# EAGLE design pcf8563 (EAGLE 7.3.0)
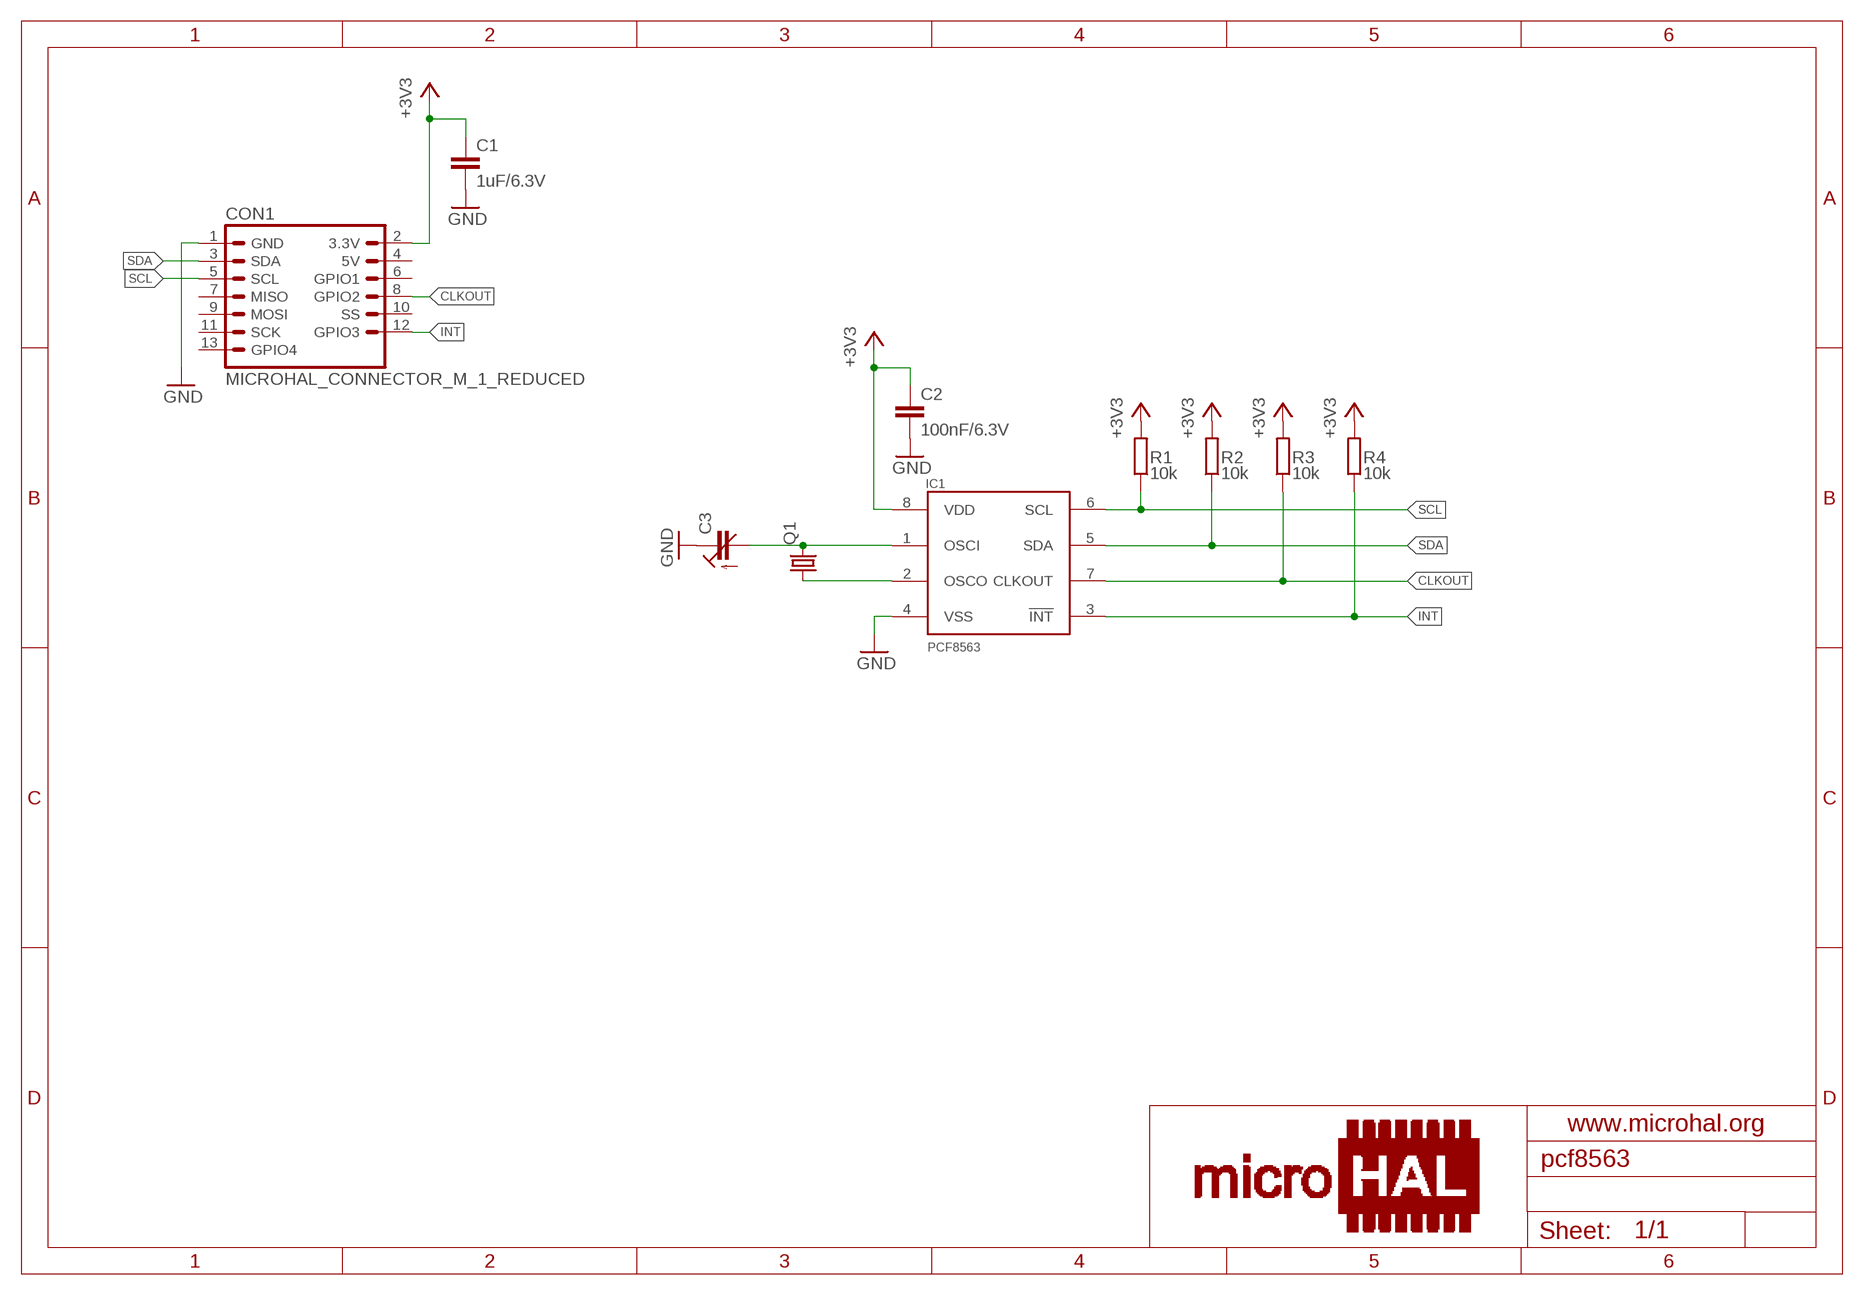
[diagram p0: schematic, sheet 1]

## Parts
C1  1uF/6.3V  C-EUC0805K  [C0805K]
C2  100nF/6.3V  C-EUC0603K  [C0603K]
C3  C-TRIMMTZBX4  [CTRIMTZBX4]
CON1  MICROHAL_CONNECTOR_M_1_REDUCED  [MICROHAL_CONNECTOR_M_1_REDUCED_EDGE]
IC1  PCF8563  [SO08]
Q1  CRYSTALTC38H  [TC38H]
R1  10k  R-EU_R0603  [R0603]
R2  10k  R-EU_R0603  [R0603]
R3  10k  R-EU_R0603  [R0603]
R4  10k  R-EU_R0603  [R0603]

## Nets
+3V3: C1.1 C2.1 CON1.2(3.3V) IC1.8(VDD) R1.2 R2.2 R3.2 R4.2
CLKOUT: CON1.8(GPIO2) IC1.7(CLKOUT) R3.1
GND: C1.2 C2.2 C3.1(E) CON1.1(GND) IC1.4(VSS)
INT: CON1.12(GPIO3) IC1.3(!INT) R4.1
N$1: C3.2(A) IC1.1(OSCI) Q1.2
N$2: IC1.2(OSCO) Q1.1
SCL: CON1.5(SCL) IC1.6(SCL) R1.1
SDA: CON1.3(SDA) IC1.5(SDA) R2.1
Unconnected: CON1.4(5V) CON1.6(GPIO1) CON1.7(MISO) CON1.9(MOSI) CON1.10(SS) CON1.11(SCK) CON1.13(GPIO4)

## Library data of the parts
C1 C2 = rcl:C-EU: CAPACITOR, European symbol
C3 = rcl:C-TRIMM: Trimm capacitor
CON1 = microhal-connector_v0.1:MICROHAL_CONNECTOR_M_1_REDUCED
IC1 = pcf8563:PCF8563
Q1 = crystal:CRYSTAL: CRYSTAL; OC_FARNELL: unknown; OC_NEWARK: unknown
R1-R4 = rcl:R-EU_: RESISTOR, European symbol

## Board
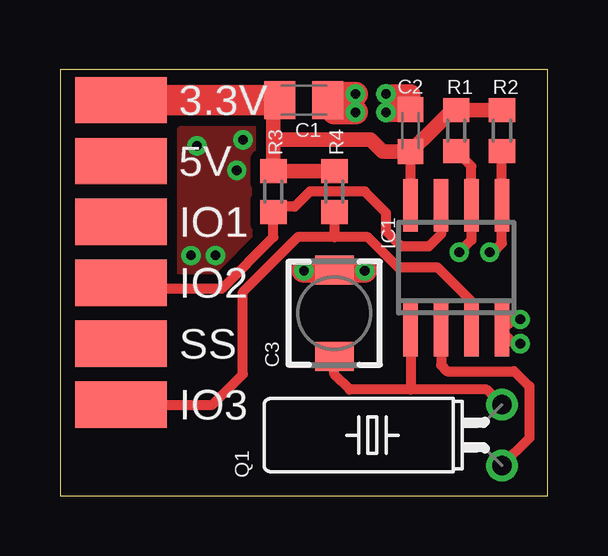
[diagram p1: board, top side]
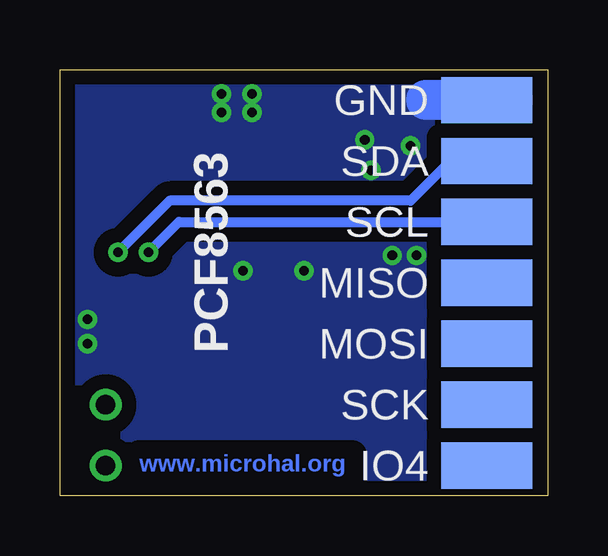
[diagram p2: board, bottom side, seen from below]

Size 20.32 x 17.78 mm. Coordinates in mm from the lower left corner, seen from the top.
Outline: 0,0 20.32,0 20.32,17.78 0,17.78 0,0
Copper layers (1*16): Top 0.035mm / dielectric 1.5mm / Bottom 0.035mm
Design rules "default *": minimum track width 10mil, minimum drill 24mil, track to track 8mil, track to pad 8mil, pad to pad 8mil, via to via 8mil, smd to smd 8mil, copper to edge 20mil, drill to drill 8mil, minimum pad ring 10mil, minimum via ring 8mil, stop-mask expansion 4mil, vias tented up to drill 0mil, thermal gap 10mil

### Footprints (pad centres in the part's own frame; a part is rotated, then mirrored left to right if it is on the bottom)
C0805K = smd 1.3 x 1.6: 1 -1,0; 2 1,0
C0603K = smd 1.05 x 1.08: 1 -0.875,0; 2 0.875,0
CTRIMTZBX4 = smd 1.6 x 1.2: 1 0,1.8; 2 0,-1.8
MICROHAL_CONNECTOR_M_1_REDUCED_EDGE = smd 1.93 x 3.81 bottom: 1 -7.62,0; 3 -5.08,0; 5 -2.54,0; 7 0,0; 9 2.54,0; 11 5.08,0; 13 7.62,0 | smd 1.93 x 3.81: 2 -7.62,0; 4 -5.08,0; 6 -2.54,0; 8 0,0; 10 2.54,0; 12 5.08,0
SO08 = smd 0.6 x 2.2: 1 -1.905,-2.6; 2 -0.635,-2.6; 3 0.635,-2.6; 4 1.905,-2.6; 5 1.905,2.6; 6 0.635,2.6; 7 -0.635,2.6; 8 -1.905,2.6
TC38H = drill 0.813: 1 -1.27,0; 2 1.27,0
R0603 = smd 1 x 1.1: 1 -0.85,0; 2 0.85,0

### Placement (x,y rotation side)
C1  10.16,16.51 0 top
C2  14.61,15.24 90 top
C3  11.43,7.62 0 top
CON1  2.54,8.89 270 top
IC1  16.51,9.53 0 top
Q1  18.41,2.54 90 top
R1  16.51,15.24 90 top
R2  18.41,15.24 90 top
R3  8.89,12.7 90 top
R4  11.43,12.7 90 top

### Tracks (layer width: path | path; a pad name or v marks a point on that pad's centre or on a via)
+3V3
  Top 0.406: IC1.8 C2.1
  Top 0.61: R2.2 R1.2 16.34,16.09 15.11,14.86 15.1,14.86 C2.1 13.45,14.37 12.95,14.86 8.89,14.86 | R4.2 R3.2 8.89,14.86 | 8.89,14.86 8.89,16.24 C1.1
  Top 1.27: CON1.2 C1.1
CLKOUT
  Top 0.406: IC1.7 15.88,10.92 15.37,10.41 14.22,10.41 13.59,11.05 13.59,11.81 12.7,12.7 10.41,12.7 9.78,12.06 9.11,12.06 R3.1 8.89,10.79 6.73,8.64 2.79,8.64 CON1.8
GND  (via drill 0.4)
  Top 0.406: v19.18,7.37 18.86,7.37 IC1.4 | v19.18,6.35 18.92,6.35 18.41,6.86
  Top 0.813: v13.59,16 14.61,16 C2.2 14.61,16.76 v13.59,16.76
  Top 1.016: v10.16,9.4 11.41,9.4 C3.1 | v12.7,9.4 11.43,9.4 | C1.2 11.41,16.76 v12.32,16.76 | v12.32,16 11.43,16 11.43,16.51
  Bottom 1.676: CON1.1 5.08,16.51
  other vias: 5.71,14.61 5.46,10.03 7.37,13.59 7.62,14.86 6.48,10.03
  pour Bottom (isolate 0.61): 0,17.78 20.32,17.78 20.32,0 0,0
  pour Top (isolate 0.406): 5.08,15.24 5.08,8.89 6.35,8.89 8.89,11.43 8.89,15.24
INT
  Top 0.406: IC1.3 17.14,8.13 15.75,9.53 14.1,9.53 12.83,10.79 11.43,10.79 | 11.43,10.79 9.91,10.79 7.62,8.51 7.62,5.08 6.35,3.81 CON1.12 | R4.1 11.43,10.79
N$1
  Top 0.406: Q1.2 17.78,4.45 14.61,4.45 | 14.61,4.45 12.06,4.45 11.43,5.08 C3.2 | IC1.1 14.61,4.45
N$2
  Top 0.406: IC1.2 15.88,5.46 16.13,5.21 18.92,5.21 19.56,4.57 19.56,2.41 Q1.1
SCL  (via drill 0.4)
  Top 0.406: R1.1 17.14,13.76 IC1.6 17.14,10.67 v16.64,10.16
  Bottom 0.406: v16.64,10.16 15.37,11.43 CON1.5
SDA  (via drill 0.4)
  Top 0.406: R2.1 IC1.5 18.41,10.54 18.03,10.16 v17.91,10.16
  Bottom 0.406: 4.06,13.97 5.71,12.32 15.75,12.32 v17.91,10.16
  Bottom 0.61: CON1.3 4.06,13.97

### Text on the board
Bottom: www.microhal.org
bNames: PCF8563
bStop: www.microhal.org